# Altium schematic sheet FLS Data Formatter Block Diagram.SchDoc: FLS Data Formatter Block Diagram
size 812 x 571 mm; CompanyName: Carnegie Observatories; DrawnBy: alanb; Engineer: Alan Bagish; Organization: Carnegie Observatories; DocumentNumber: 1; Revision: A; SheetNumber: 1; SheetTotal: 3; PageSetup: Record=PageOptions|CenterHorizontal=True|CenterVertical=True|PrintScale=0.34|XCorrection=1.00|YCorrection=1.00|PrintKind=0|BorderSize=5000000|LeftOffset=0|BottomOffset=0|Orientation=2|PaperLength=1000|PaperWidth=1000|Scale=100|PaperSource=259|PrintQuality=600|MediaType=1|DitherType=10|PaperKind=Letter (8.5 x 11")|PrintScaleMode=1; ProjectName: M2FS
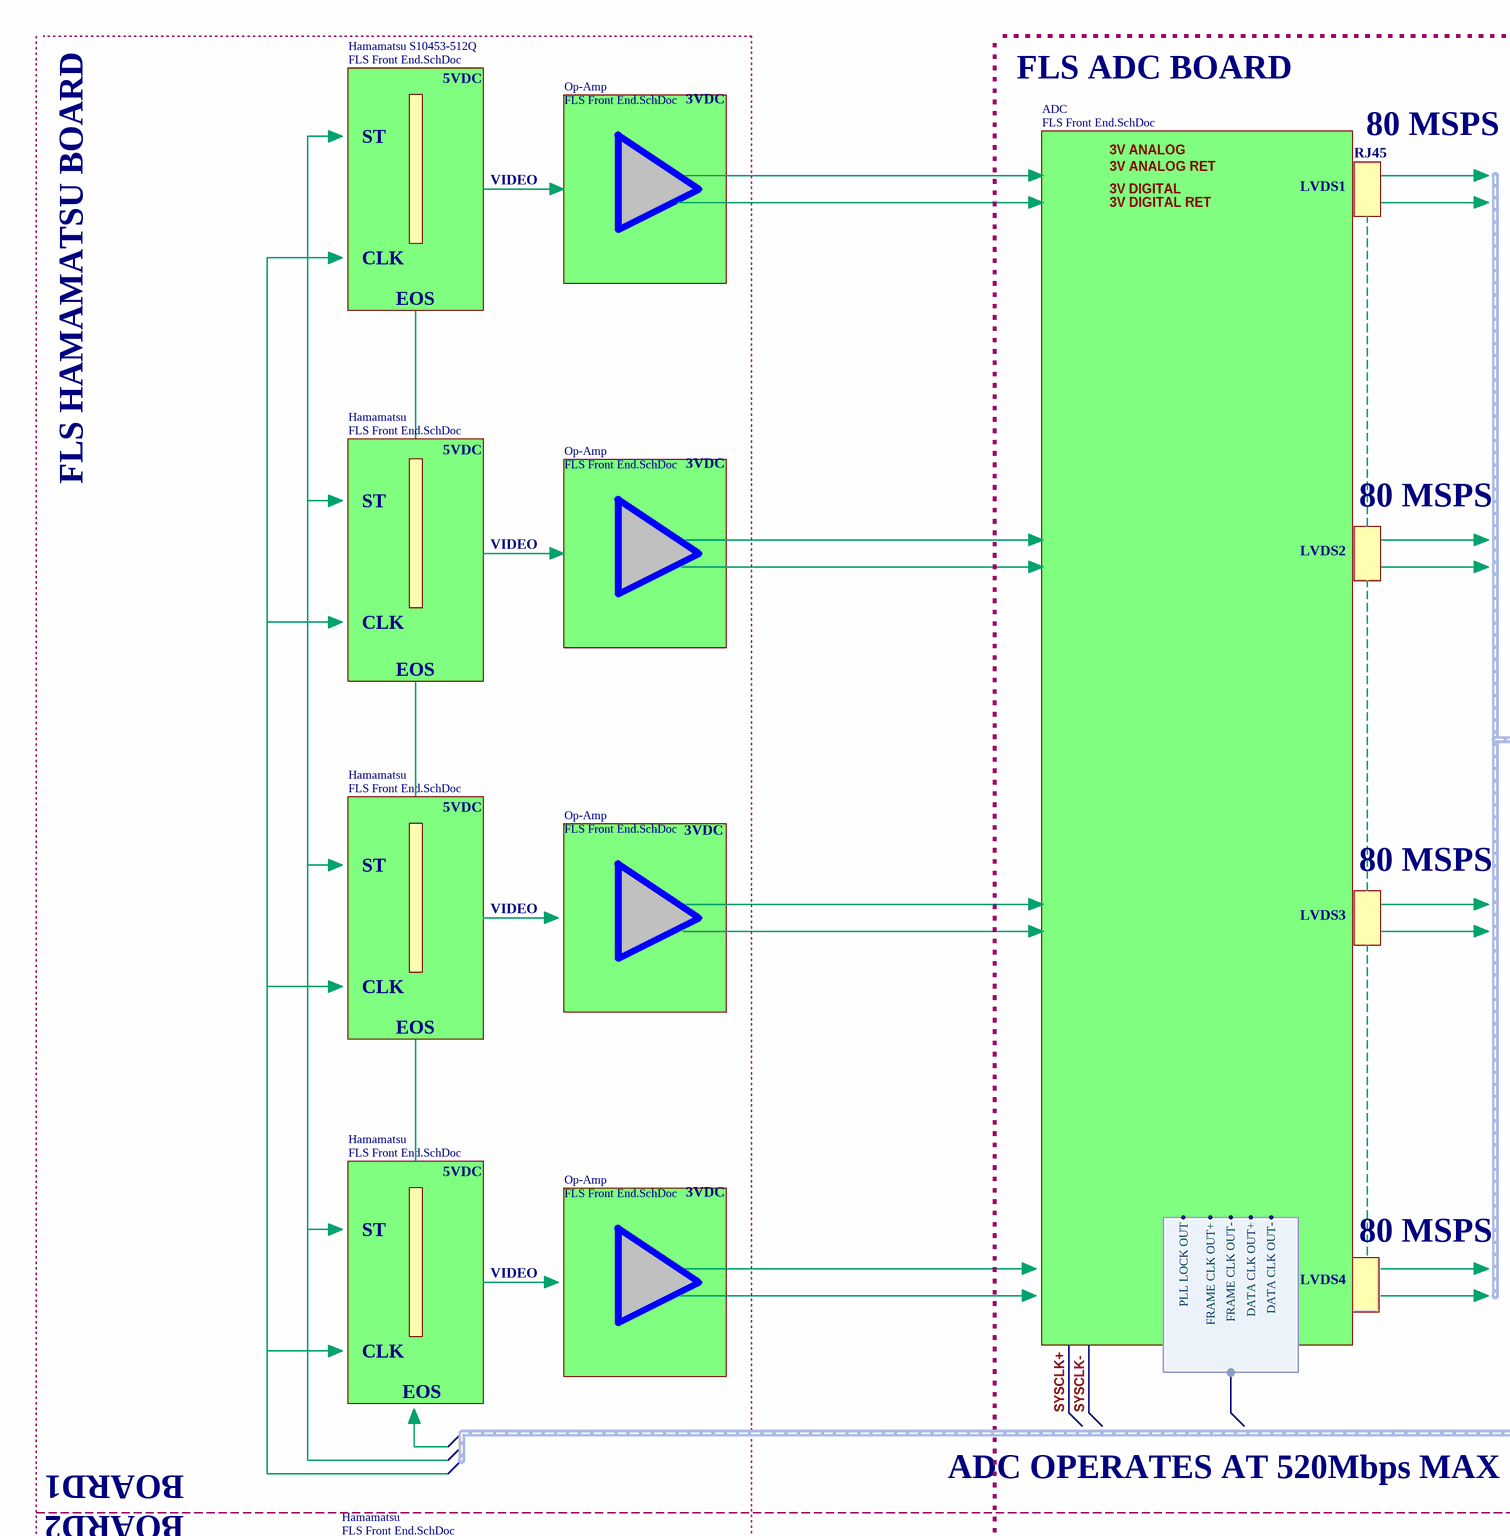
[diagram p0: FLS Data Formatter Block Diagram.SchDoc, top left]
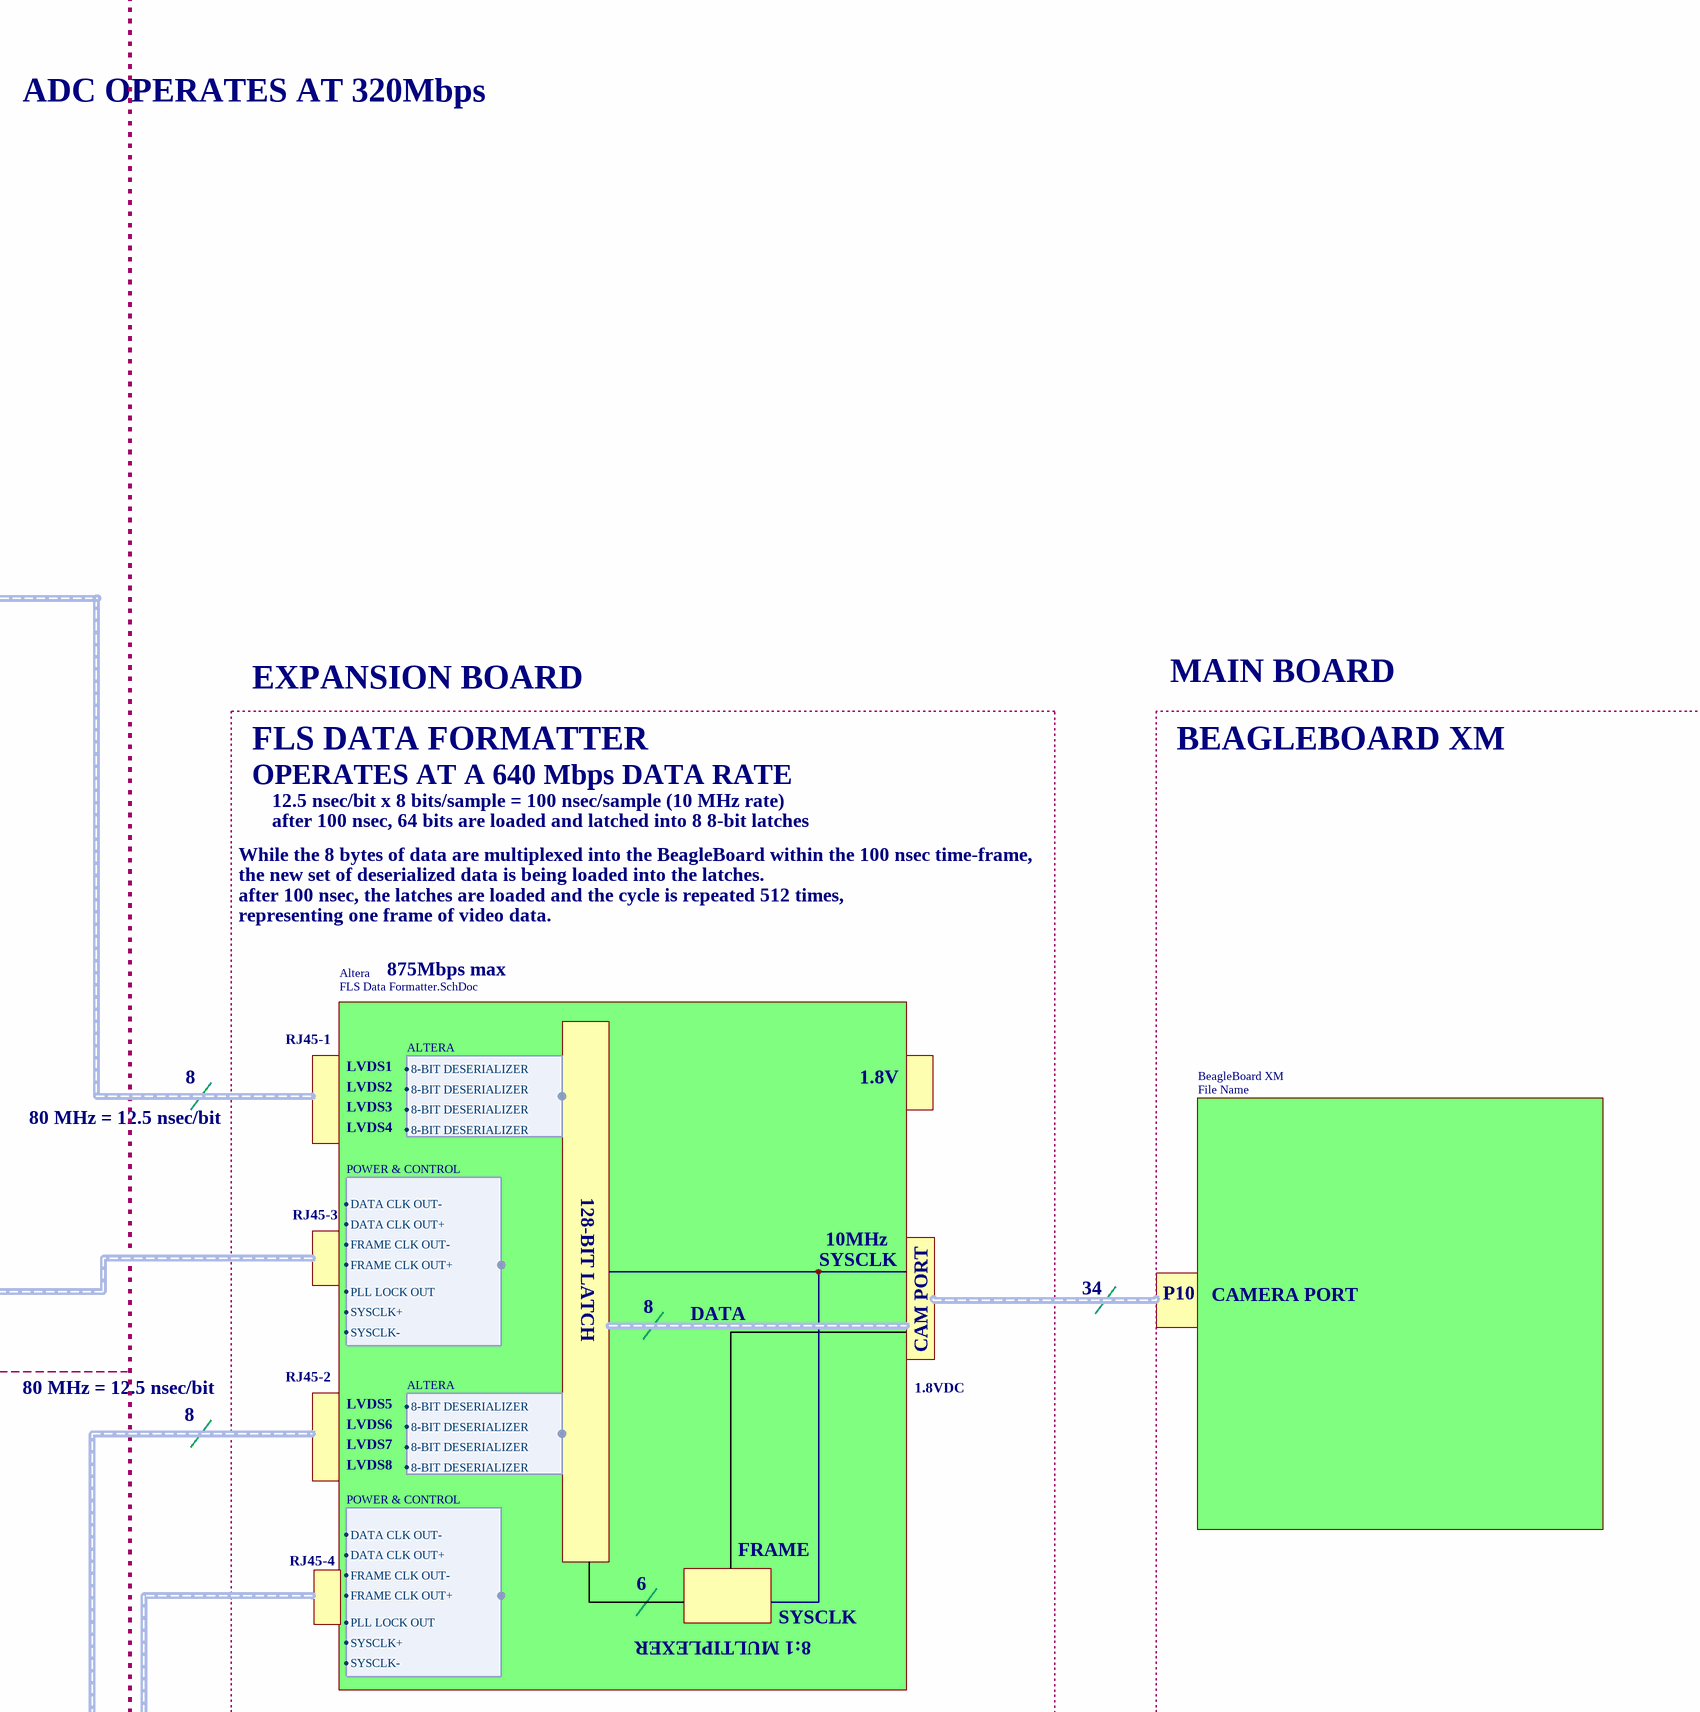
[diagram p1: FLS Data Formatter Block Diagram.SchDoc, top right]
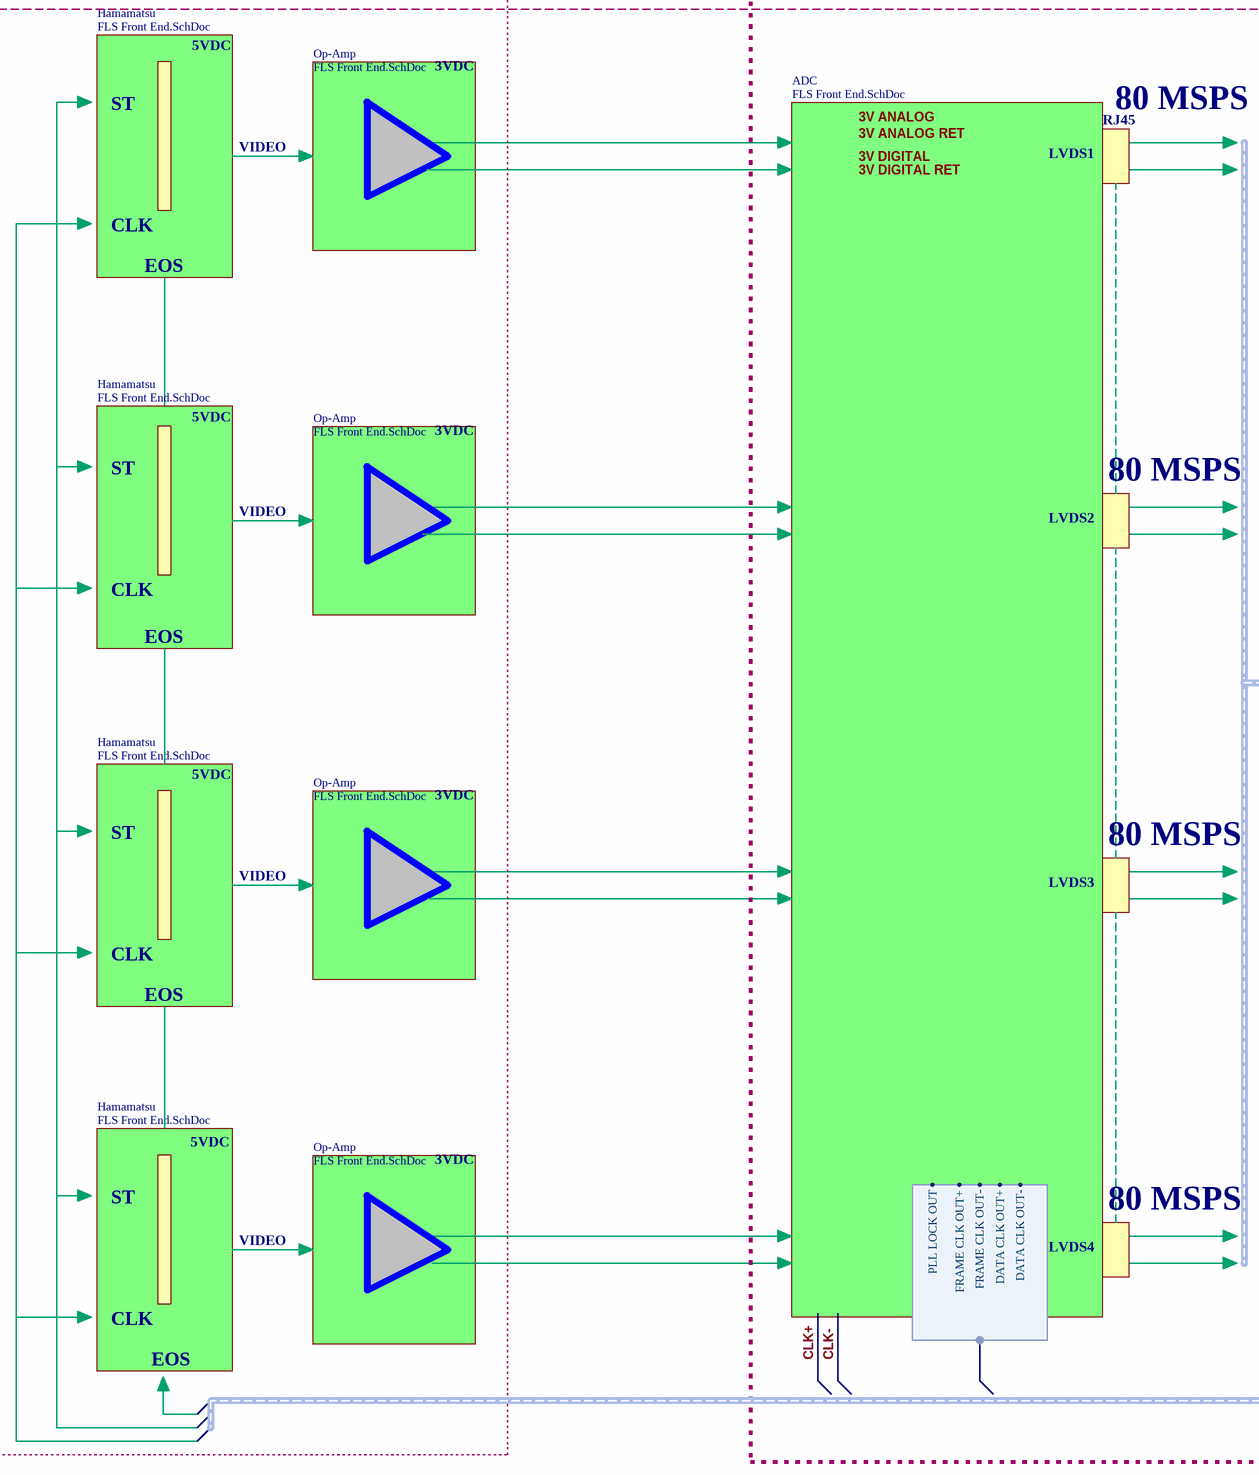
[diagram p2: FLS Data Formatter Block Diagram.SchDoc, bottom left]
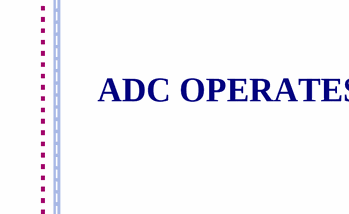
[diagram p3: FLS Data Formatter Block Diagram.SchDoc, bottom right]

## Sub-sheets
ADC = FLS Front End.SchDoc: no entries
ADC = FLS Front End.SchDoc: no entries
Altera = FLS Data Formatter.SchDoc: no entries
BeagleBoard XM = File Name: no entries
Hamamatsu = FLS Front End.SchDoc: no entries
Hamamatsu = FLS Front End.SchDoc: no entries
Hamamatsu = FLS Front End.SchDoc: no entries
Hamamatsu = FLS Front End.SchDoc: no entries
Hamamatsu = FLS Front End.SchDoc: no entries
Hamamatsu = FLS Front End.SchDoc: no entries
Hamamatsu = FLS Front End.SchDoc: no entries
Hamamatsu S10453-512Q = FLS Front End.SchDoc: no entries
Op-Amp = FLS Front End.SchDoc: no entries
Op-Amp = FLS Front End.SchDoc: no entries
Op-Amp = FLS Front End.SchDoc: no entries
Op-Amp = FLS Front End.SchDoc: no entries
Op-Amp = FLS Front End.SchDoc: no entries
Op-Amp = FLS Front End.SchDoc: no entries
Op-Amp = FLS Front End.SchDoc: no entries
Op-Amp = FLS Front End.SchDoc: no entries

## Harnesses
Harness: PLL LOCK OUT, FRAME CLK OUT+, FRAME CLK OUT-, DATA CLK OUT+, DATA CLK OUT-
ALTERA: 8-BIT DESERIALIZER, 8-BIT DESERIALIZER, 8-BIT DESERIALIZER, 8-BIT DESERIALIZER
POWER & CONTROL: PLL LOCK OUT, FRAME CLK OUT+, FRAME CLK OUT-, DATA CLK OUT+, DATA CLK OUT-, SYSCLK+, SYSCLK-

## Notes on the sheet
- 5VDC
- 3VDC
- FLS ADC BOARD
- ST
- VIDEO
- LVDS1
- RJ45
- 80 MSPS
- CLK
- ADC OPERATES AT 320Mbps
- EOS
- FLS HAMAMATSU BOARD
- LVDS2
- EXPANSION BOARD
- MAIN BOARD
- LVDS3
- FLS DATA FORMATTER
- OPERATES AT A 640 Mbps DATA RATE
- BEAGLEBOARD XM
- While the 8 bytes of data are multiplexed into the BeagleBoard within the 100 nsec time-frame,
- after 100 nsec, 64 bits are loaded and latched into 8 8-bit latches
- 12.5 nsec/bit x 8 bits/sample = 100 nsec/sample (10 MHz rate)
- the new set of deserialized data is being loaded into the latches.
- after 100 nsec, the latches are loaded and the cycle is repeated 512 times,
- representing one frame of video data.
- 875Mbps max
- RJ45-1
- 80 MHz = 12.5 nsec/bit
- 8
- LVDS4
- 1.8V
- 128-BIT LATCH
- RJ45-3
- SYSCLK
- 10MHz
- BOARD1
- DATA
- 34
- P10
- CAMERA PORT
- BOARD2
- ADC OPERATES AT 520Mbps MAX
- RJ45-2
- LVDS5
- 1.8VDC
- CAM PORT
- LVDS6
- LVDS7
- LVDS8
- RJ45-4
- 6
- FRAME
- 8:1 MULTIPLEXER
- Labels drawn without touching a wire or pin: 3V ANALOG, 3V ANALOG RET, 3V DIGITAL, 3V DIGITAL RET
- Carnegie Institution of Washington
- Pasadena, California 91101
- 813 Santa Barbara Street
- The Observatories
- PHONE (626) 577-1122               FAX (626) 795-8136
- Title:
- OCIW
- Size:
- Date:
- File:
- D
- Scale:
- Drawn By:
- Checked By:
- A. BAGISH
- alanb
- Revision:
- Sheet          of